# Altium schematic sheet Power.SchDoc
size A4; SheetNumber: 7; SheetTotal: 7
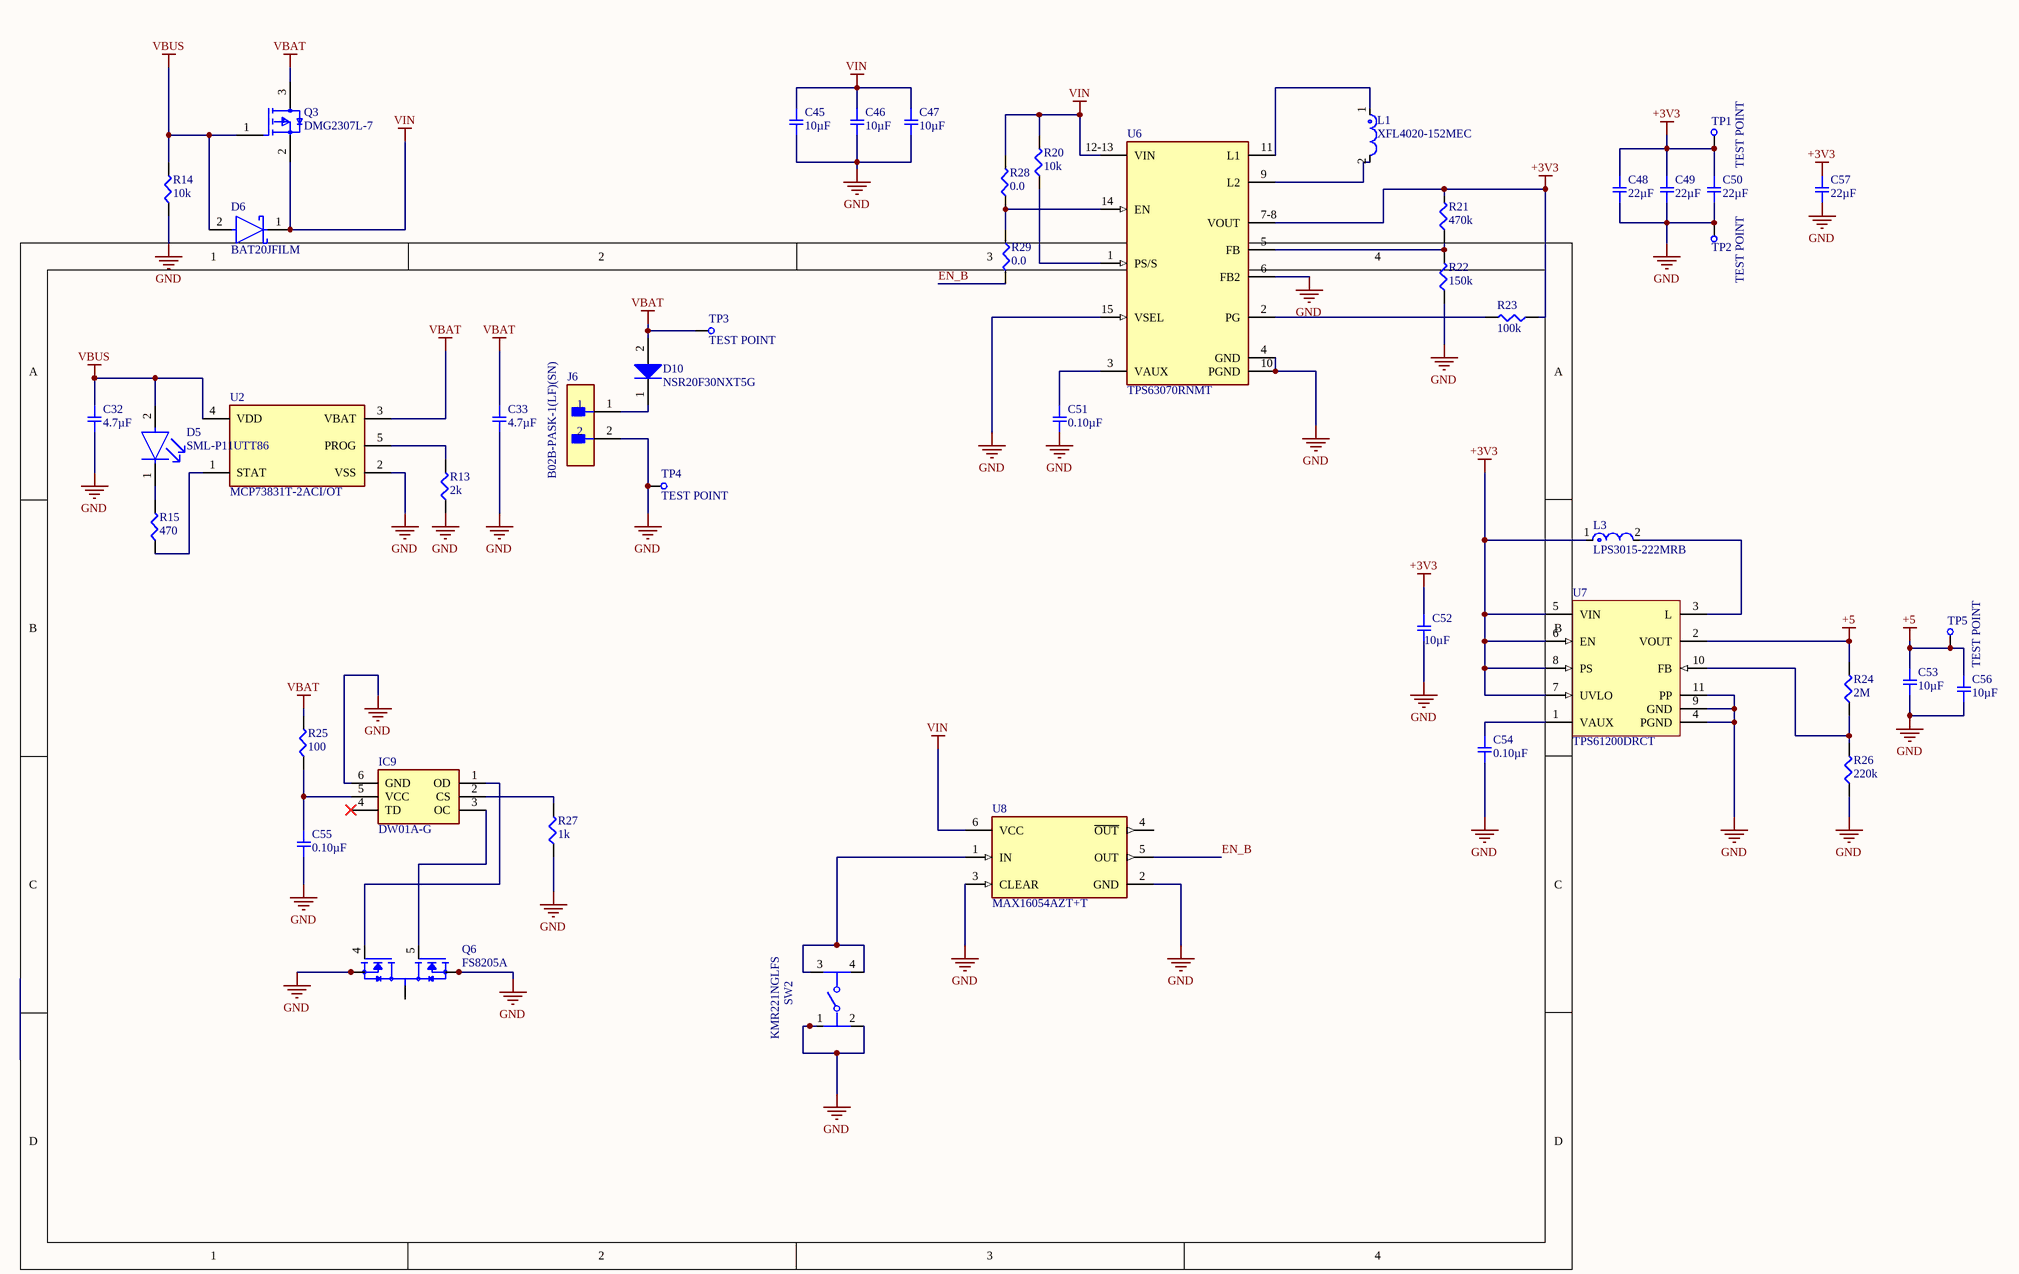
[diagram p0: Power.SchDoc]

## Parts
C32  4.7µF  [SMD-0402C]
C33  4.7µF  [SMD-0402C]
C45  10µF  [SMD-0805C]
C46  10µF  [SMD-0805C]
C47  10µF  [SMD-0603C]
C48  22µF  [SMD-0805C]
C49  22µF  [SMD-0805C]
C50  22µF  [SMD-0805C]
C51  0.10µF  [SMD-0402C]
C52  10µF  [SMD-0603C]
C53  10µF  [SMD-0603C]
C54  0.10µF  [SMD-0402C]
C55  0.10µF  [SMD-0402C]
C56  10µF  [SMD-0603C]
C57  22µF  [SMD-0603C]
D5  SML-P11UTT86  [FP-SML-P11UTT86-MFG]
D6  BAT20JFILM  [FP-BAT20JFILM-MFG]
D10  NSR20F30NXT5G  [ONSC-DSN-2-512AB-01_V]
IC9  DW01A-G  [SOT95P190X145-6N]
J6  B02B-PASK-1(LF)(SN)  [FP-B02B-PASK-1_LF_SN-MFG]
L1  XFL4020-152MEC  [FP-XFL4020-MFG]
L3  LPS3015-222MRB  [FP-LPS3015-MFG]
Q3  DMG2307L-7  [FP-SOT23-IPC_A]
Q6  FS8205A  [SOP65P640X120-8N]
R13  2k  [SMD-0402-RES]
R14  10k  [SMD-0402-RES]
R15  470  [SMD-0402-RES]
R20  10k  [SMD-0402-RES]
R21  470k  [SMD-0402-RES]
R22  150k  [SMD-0402-RES]
R23  100k  [SMD-0402-RES]
R24  2M  [SMD-0402-RES]
R25  100  [SMD-0402-RES]
R26  220k  [SMD-0402-RES]
R27  1k  [SMD-0402-RES]
R28  0.0  [SMD-0402-RES]
R29  0.0  [SMD-0402-RES]
SW2  KMR221NGLFS  [FP-KMR221NGLFS-0]
TP1  TEST POINT  [TEST POINT_30]
TP2  TEST POINT  [TEST POINT_30]
TP3  TEST POINT  [TEST POINT_30]
TP4  TEST POINT  [TEST POINT_30]
TP5  TEST POINT  [TEST POINT_30]
U2  MCP73831T-2ACI/OT  [FP-C04-091-OT-IPC_B]
U6  TPS63070RNMT  [FP-RNM0015A-MFG]
U7  TPS61200DRCT  [DRC0010J_V]
U8  MAX16054AZT+T  [FP-Z6-1-MFG]

## Nets
+3V3: C48.1 C49.1 C50.1 C52.1 C57.1 L3.1 R21.2 R23.1 TP1.1 U6.7-8(VOUT) U7.5(VIN) U7.6(EN) U7.7(UVLO) U7.8(PS)
+5: C53.1 C56.1 R24.2 TP5.1 U7.2(VOUT)
GND: C32.2 C33.2 C45.2 C46.2 C47.2 C48.2 C49.2 C50.2 C51.2 C52.2 C53.2 C54.2 C55.2 C56.2 C57.2 IC9.6(GND) J6.2 Q6.2(S1) Q6.3(S1) Q6.6(S2) Q6.7(S2) R13.1 R14.1 R22.1 R26.1 R27.1 SW2.1 SW2.2 TP2.1 TP4.1 U2.2(VSS) U6.4(GND) U6.6(FB2) U6.10(PGND) U6.15(VSEL) U7.4(PGND) U7.9(GND) U7.11(PP) U8.2(GND) U8.3(CLEAR)
VBAT: C33.1 D10.2(A) Q3.3(D) R25.2 TP3.1 U2.3(VBAT)
VBUS: C32.1 D5.2(A) D6.2(A) Q3.1(G) R14.2 U2.4(VDD)
VIN: C45.1 C46.1 C47.1 D6.1(K) Q3.2(S) R20.2 R28.2 U6.12-13(VIN) U8.6(VCC)
EN_B: R29.2 U8.5(OUT)
NetC51_1: C51.1 U6.3(VAUX)
NetC54_1: C54.1 U7.1(VAUX)
NetC55_1: C55.1 IC9.5(VCC) R25.1
NetD5_1: D5.1(C) R15.2
NetD10_1: D10.1(K) J6.1
NetIC9_1: IC9.1(OD) Q6.4(G1)
NetIC9_2: IC9.2(CS) R27.2
NetIC9_3: IC9.3(OC) Q6.5(G2)
NetL1_1: L1.1 U6.11(L1)
NetL1_2: L1.2 U6.9(L2)
NetL3_2: L3.2 U7.3(L)
NetQ6_1: Q6.1(D12) Q6.8(D12)
NetR13_2: R13.2 U2.5(PROG)
NetR15_1: R15.1 U2.1(STAT)
NetR20_1: R20.1 U6.1(PS/S)
NetR21_1: R21.1 R22.2 U6.5(FB)
NetR23_2: R23.2 U6.2(PG)
NetR24_1: R24.1 R26.2 U7.10(FB)
NetR28_1: R28.1 R29.1 U6.14(EN)
NetSW2_3: SW2.3 SW2.4 U8.1(IN)

Not connected (* = marked no-connect by the designer): IC9 4(TD)*; U8 4(~{OUT})

## Library data of the parts
C32 C33 = ZRB15XR61A475KE01D: CAP CER 4.7UF 10V X5R 0402; Manufacturer: Murata Electronics North America; Factory Stock: 0; Unit Price (USD): 0.28; Minimum Quantity: 1; Tolerance: ±10%; Datasheets: http://search.murata.co.jp/Ceramy/image/img/A01X/G101/ENG/ZRB15XR61A475KE01-01.pdf; Image: //media.digikey.com/Renders/Murata%20Renders/ZRB-SERIES-0402.jpg; Digi-Key Part Number: 490-13252-1-ND; Part Number: ZRB15XR61A475KE01D; Quantity Available: 23076; @ qty: 0; Packaging: Cut Tape (CT); Series: ZRB; Part Status: Active; Value: 4.7µF; Voltage: 10V; Temperature Coefficient: X5R; Operating Temperature: -55°C ~ 85°C; Features: Derating Recommended, Interposer Termination; Ratings: -; Applications: Acoustic Noise Reduction; Mounting Type: Surface Mount, MLCC; Package / Case: 0402 (1005 Metric); Size / Dimension: 0.039" L x 0.020" W (1.00mm x 0.50mm); Height - Seated (Max): -; Thickness (Max): 0.031" (0.80mm); Lead Spacing: -; Lead Style: -
C45 C46 = GCJ21BR71A106KE01L: CAP CER 10UF 10V X7R 0805; Manufacturer: Murata Electronics North America; Factory Stock: 0; Unit Price (USD): 0.56; Minimum Quantity: 1; Tolerance: ±10%; Datasheets: http://www.murata.com/~/media/webrenewal/support/library/catalog/products/capacitor/mlcc/c03e.ashx; Image: //media.digikey.com/Renders/Murata%20Renders/0805%20(2012%20Metric)%20.85mm.jpg; Digi-Key Part Number: 490-12646-1-ND; Part Number: GCJ21BR71A106KE01L; Quantity Available: 2702; @ qty: 0; Packaging: Cut Tape (CT); Series: GCJ; Part Status: Active; Value: 10µF; Voltage: 10V; Temperature Coefficient: X7R; Operating Temperature: -55°C ~ 125°C; Features: Soft Termination; Ratings: AEC-Q200; Applications: Automotive, Boardflex Sensitive; Mounting Type: Surface Mount, MLCC; Package / Case: 0805 (2012 Metric); Size / Dimension: 0.079" L x 0.049" W (2.00mm x 1.25mm); Height - Seated (Max): -; Thickness (Max): 0.057" (1.45mm); Lead Spacing: -; Lead Style: -
C47 = GRM188C81C106MA73D: CAP CER 10UF 16V X6S 0603; Manufacturer: Murata Electronics North America; Factory Stock: 0; Unit Price (USD): 0.34; Minimum Quantity: 1; Tolerance: ±20%; Datasheets: http://www.murata.com/~/media/webrenewal/support/library/catalog/products/capacitor/mlcc/c02e.pdf; Image: //media.digikey.com/Renders/Murata%20Renders/ZRB-SERIES-0402.jpg; Digi-Key Part Number: 490-7198-1-ND; Part Number: GRM188C81C106MA73D; Quantity Available: 215049; @ qty: 0; Packaging: Cut Tape (CT); Series: GRM; Part Status: Active; Value: 10µF; Voltage: 16V; Temperature Coefficient: X6S; Operating Temperature: -55°C ~ 105°C; Features: -; Ratings: -; Applications: General Purpose; Mounting Type: Surface Mount, MLCC; Package / Case: 0603 (1608 Metric); Size / Dimension: 0.063" L x 0.031" W (1.60mm x 0.80mm); Height - Seated (Max): -; Thickness (Max): 0.031" (0.80mm); Lead Spacing: -; Lead Style: -
C48-C50 = GRM219R61A226MEA0D: CAP CER 22UF 10V X5R 0805; Manufacturer: Murata Electronics North America; Factory Stock: 0; Unit Price (USD): 0.4; Minimum Quantity: 1; Tolerance: ±20%; Datasheets: http://www.murata.com/~/media/webrenewal/support/library/catalog/products/capacitor/mlcc/c02e.pdf; Image: //media.digikey.com/Renders/Murata%20Renders/0805%20(2012%20Metric)%20.85mm.jpg; Digi-Key Part Number: 490-9951-1-ND; Part Number: GRM219R61A226MEA0D; Quantity Available: 179544; @ qty: 0; Packaging: Cut Tape (CT); Series: GRM; Part Status: Active; Value: 22µF; Voltage: 10V; Temperature Coefficient: X5R; Operating Temperature: -55°C ~ 85°C; Features: Derating Recommended; Ratings: -; Applications: General Purpose; Mounting Type: Surface Mount, MLCC; Package / Case: 0805 (2012 Metric); Size / Dimension: 0.079" L x 0.049" W (2.00mm x 1.25mm); Height - Seated (Max): -; Thickness (Max): 0.037" (0.95mm); Lead Spacing: -; Lead Style: -
C51 C54 C55 = GCM155R71C104KA55D: CAP CER 0.1UF 16V X7R 0402; Manufacturer: Murata Electronics North America; Factory Stock: 0; Unit Price (USD): 0.1; Minimum Quantity: 1; Tolerance: ±10%; Datasheets: http://www.murata.com/~/media/webrenewal/support/library/catalog/products/capacitor/mlcc/c03e.ashx; Image: //media.digikey.com/Renders/Murata%20Renders/ZRB-SERIES-0402.jpg; Digi-Key Part Number: 490-4759-1-ND; Part Number: GCM155R71C104KA55D; Quantity Available: 734194; @ qty: 0; Packaging: Cut Tape (CT); Series: GCM; Part Status: Active; Value: 0.10µF; Voltage: 16V; Temperature Coefficient: X7R; Operating Temperature: -55°C ~ 125°C; Features: -; Ratings: AEC-Q200; Applications: Automotive; Mounting Type: Surface Mount, MLCC; Package / Case: 0402 (1005 Metric); Size / Dimension: 0.039" L x 0.020" W (1.00mm x 0.50mm); Height - Seated (Max): -; Thickness (Max): 0.022" (0.55mm); Lead Spacing: -; Lead Style: -
C52 C53 C56 = GRM188R61C106MAALD: CAP CER 10UF 16V X5R 0603; Manufacturer: Murata Electronics North America; Factory Stock: 0; Unit Price (USD): 0.34; Minimum Quantity: 1; Tolerance: ±20%; Datasheets: http://www.murata.com/~/media/webrenewal/support/library/catalog/products/capacitor/mlcc/c02e.pdf; Image: //media.digikey.com/Renders/Murata%20Renders/ZRB-SERIES-0402.jpg; Digi-Key Part Number: 490-10729-1-ND; Part Number: GRM188R61C106MAALD; Quantity Available: 8571; @ qty: 0; Packaging: Cut Tape (CT); Series: GRM; Part Status: Active; Value: 10µF; Voltage: 16V; Temperature Coefficient: X5R; Operating Temperature: -55°C ~ 85°C; Features: -; Ratings: -; Applications: General Purpose; Mounting Type: Surface Mount, MLCC; Package / Case: 0603 (1608 Metric); Size / Dimension: 0.063" L x 0.031" W (1.60mm x 0.80mm); Height - Seated (Max): -; Thickness (Max): 0.037" (0.95mm); Lead Spacing: -; Lead Style: -
C57 = GRM187R61A226ME15D: CAP CER 22UF 10V X5R 0603; Manufacturer: Murata Electronics North America; Factory Stock: 0; Unit Price (USD): 0.54; Minimum Quantity: 1; Tolerance: ±20%; Datasheets: http://psearch.en.murata.com/capacitor/product/GRM187R61A226ME15%23.pdf; Image: //media.digikey.com/Renders/Murata%20Renders/ZRB-SERIES-0402.jpg; Digi-Key Part Number: 490-13243-1-ND; Part Number: GRM187R61A226ME15D; Quantity Available: 10253; @ qty: 0; Packaging: Cut Tape (CT); Series: GRM; Part Status: Active; Value: 22µF; Voltage: 10V; Temperature Coefficient: X5R; Operating Temperature: -55°C ~ 85°C; Features: Derating Recommended; Ratings: -; Applications: General Purpose; Mounting Type: Surface Mount, MLCC; Package / Case: 0603 (1608 Metric); Size / Dimension: 0.063" L x 0.031" W (1.60mm x 0.80mm); Height - Seated (Max): -; Thickness (Max): 0.031" (0.80mm); Lead Spacing: -; Lead Style: -
D5 = CMP-08952-000028-1: LED RED CLEAR 1006 SMD; Number of LEDs: 1; Lens Color: Colorless; Viewing Angle: 150°; Dominant Wavelength: 621nm; Luminous Intensity: 5.5mcd; Forward Voltage: 1.8V; Lens Style: Square; Test Current: 1mA; Forward Current: 20mA; Height: 0.25mm; Radiation Hardening: No; Color: Red; Case Code (Metric): 1005; Number of Pins: 2; RoHS Compliant: Yes; Max Operating Temperature: 85°C; Package Quantity: 1; Wavelength: 621nm; Lens Transparency: Clear; Packaging: Tape and Reel; Lead Free: Lead Free; Illumination Color: Red; Case/Package: 0402; Case Code (Imperial): 0402; Mount: Surface Mount; Min Operating Temperature: -40°C; Width: 0.6mm; Length: 1mm; Series: PicoLED™; REACH SVHC: No SVHC
D6 = CMP-12187-000030-1: DIODE SCHOTTKY 23V 1A SOD323; Polarity: Standard; Element Configuration: Single; Capacitance: 30pF; Forward Voltage: 620mV; Max Surge Current: 5A; Peak Reverse Current: 12uA; Packaging: Tape and Reel; Weight: 0.01lb; Output Current: 1A; Lead Free: Lead Free; Forward Current: 1A; Mount: Surface Mount; Max Reverse Voltage (DC): 23V; Average Rectified Current: 1A; Max Operating Temperature: 150°C; Max Forward Surge Current (Ifsm): 5A; REACH SVHC: No SVHC; Current Rating: 1A; Length: 1.8mm; Radiation Hardening: No; Max Reverse Leakage Current: 12uA; Voltage Rating (DC): 23V; Height: 1.03mm; Peak Non-Repetitive Surge Current: 5A; Max Repetitive Reverse Voltage (Vrrm): 23V; Min Operating Temperature: -65°C; Number of Pins: 2; Width: 1.35mm; Package Quantity: 1
D10 = CMP-1055-00233-1: Schottky Barrier Diode, 2-Pin DSN, Pb-Free, Tape and Reel; Manufacturer: On Semiconductor; IFSM Max (A): 28; Configuration: Single; ComponentLink2URL: http://www.onsemi.com/pub_link/Collateral/NSR20F30-D.PDF; ComponentLink1URL: http://www.onsemi.com/; ComponentLink2Description: Datasheet; PackageVersion: Rev. B, 01/2011; Mounting Technology: Surface Mount; DatasheetVersion: Rev. 3; Packing: Tape and Reel; PartNumber: NSR20F30NXT5G; ComponentLink3Description: Package Specification; RoHS: TRUE; PackageDescription: 2-Pin Micro Molded Package, Body 1.6 x 0.8 mm; ComponentLink3URL: http://www.onsemi.cn/pub_link/Collateral/152AB.PDF; ComponentLink1Description: Manufacturer URL; PackageReference: DSN-2-512AB-01
IC9 = DW01A-G: Integrated Circuit; Manufacturer_Name: SII Semiconductor; Datasheet Link: http://www.ic-fortune.com/upload/Download/DW01x-DS-17_EN.pdf; Height: 1.45mm; Manufacturer_Part_Number: DW01A-G
J6 = CMP-17439-000415-1: CONN HEADER VERT 2POS 2MM; Number of Contacts: 2; Current Rating: 3A; Insulation Resistance: 1GR; Mated Stacking Heights: 14.9mm; Voltage Rating: 250V; Gender: Male; Pitch: 2mm; Orientation: Straight; Contact Finish - Mating: TIN; Mount: Through Hole; Contact Type: Male Pin; Number of Rows: 1; Fastening Type: Ramp; Series: PA; Connector Type: Header; Insulation Color: Natural; Flammability Rating: UL94 V-0; Material: Polybutylene; Contact Shape: Square; Contact Plating: Tin; Insulation Material: PBT; Max Operating Temperature: 85°C; Housing Color: White; Number of Positions: 2; Contact Material: Copper Alloy; Min Operating Temperature: -25°C; Lead Free: Lead Free; Contact Mating Length: 0.126inch; Termination: Solder; Packaging: Bulk; Color: Natural
L1 = CMP-11268-000104-1: Inductor Power Shielded Wirewound 1.5uH 20% 100KHz 9.1A 15.8mOhm DCR 1515 Automotive Embossed Plastic T/R; Core Material: Composite; DC Resistance (DCR): 15.8mR; Saturation Current: 4.1A; Self Resonant Frequency: 59MHz; Tolerance: 20%; Inductance: 1.5uH; Max DC Current: 9.1A; RoHS Compliant: Yes; Max Operating Temperature: 125°C; Length: 4.3mm; Case/Package: SMD/SMT; Mount: Surface Mount; Shielding: Shielded; Min Operating Temperature: -40°C; RMS Current (Irms): 9.1A; Test Frequency: 100kHz; Inductance Tolerance: 20%; REACH SVHC: No SVHC; Packaging: Tape and Reel; Termination: SMD/SMT; Lead Free: Contains Lead; Width: 4.3mm; Series: XFL4020; Height: 2.1mm
L3 = CMP-2000-06574-2: Fixed Inductors LPS3015 AEC-Q200 2.2uH 1.4A 20% SMD; Max DC Current: 2.1A; RMS Current (Irms): 1.1A; DC Resistance (DCR): 110mR; Core Material: Ferrite; Saturation Current: 2A; Shielding: Shielded; Test Frequency: 100kHz; Self Resonant Frequency: 110MHz; REACH SVHC: No SVHC; Weight: 0.001411oz; Height: 1.4mm; Max Operating Temperature: 85°C; Termination: SMD/SMT; Inductance Tolerance: 20%; Packaging: Cut Tape; Min Operating Temperature: -40°C; Inductance: 2.2uH; Width: 3mm; Package Quantity: 1; Tolerance: 20%; Length: 3mm
Q3 = CMP-12801-000080-1: MOSFET P-CH 30V 2.5A SOT-23; Gate to Source Voltage (Vgs): 20V; Rise Time: 7.3ns; Power Dissipation: 1.36W; Rds On Max: 90mR; Fall Time: 13.4ns; Number of Channels: 1; Turn-On Delay Time: 4.8ns; Element Configuration: Single; Turn-Off Delay Time: 22.4ns; Input Capacitance: 371.3pF; Continuous Drain Current (ID): 3.8A; Max Power Dissipation: 760mW; Min Operating Temperature: -55°C; Width: 1.4mm; Packaging: Tape and Reel; Max Operating Temperature: 150°C; Case/Package: SOT-23; Weight: 0.000282oz; Length: 3mm; Lead Free: Lead Free; Package Quantity: 3000; Radiation Hardening: No; Drain to Source Resistance: 90mR; Height: 1mm; REACH SVHC: No SVHC; Number of Pins: 3; Number of Elements: 1; Drain to Source Voltage (Vdss): 30V; Mount: Surface Mount
Q6 = FS8205A: N/A; MF: Fortune Semiconductor; MP: FS8205A; Value: *; Availability: Not in stock; Package: Package; Price: None; SnapEDA_Link: https://www.snapeda.com/parts/FS8205A/Fortune+Semiconductor/view-part/?ref=snap; Check_prices: https://www.snapeda.com/parts/FS8205A/Fortune+Semiconductor/view-part/?ref=eda
R13 = ERJ-2GEJ202X: RES SMD 2K OHM 5% 1/10W 0402; Manufacturer: Panasonic Electronic Components; Factory Stock: 0; Unit Price (USD): 0.00350; @ qty: 1500; Minimum Quantity: 1; Power (Watts): 0.1W, 1/10W; Temperature Coefficient: ±200ppm/°C; Part Number: ERJ-2GEJ202X; Datasheets: http://industrial.panasonic.com/www-cgi/jvcr13pz.cgi?E+PZ+3+AOA0001+ERJ2GEJ202X+7+WW; Image: //media.digikey.com/Photos/Panasonic%20Photos/ERJ-PA2-Series.jpg; Digi-Key Part Number: P2.0KJCT-ND; Quantity Available: 185761; Packaging: Cut Tape (CT); Series: ERJ; Part Status: Active; Value: 2k; Tolerance: ±5%; Composition: Thick Film; Features: Automotive AEC-Q200; Operating Temperature: -55°C ~ 155°C; Package / Case: 0402 (1005 Metric); Supplier Device Package: 0402; Size / Dimension: 0.039" L x 0.020" W (1.00mm x 0.50mm); Height - Seated (Max): 0.016" (0.40mm); Number of Terminations: 2; Failure Rate: -
R14 R20 = ERJ-2GEJ103X: RES SMD 10K OHM 5% 1/10W 0402; Manufacturer: Panasonic Electronic Components; Factory Stock: 0; Unit Price (USD): 0.00350; @ qty: 1500; Minimum Quantity: 1; Power (Watts): 0.1W, 1/10W; Temperature Coefficient: ±200ppm/°C; Part Number: ERJ-2GEJ103X; Datasheets: http://industrial.panasonic.com/www-cgi/jvcr13pz.cgi?E+PZ+3+AOA0001+ERJ2GEJ103X+7+WW; Image: //media.digikey.com/Photos/Panasonic%20Photos/ERJ-PA2-Series.jpg; Digi-Key Part Number: P10KJCT-ND; Quantity Available: 2560215; Packaging: Cut Tape (CT); Series: ERJ; Part Status: Active; Value: 10k; Tolerance: ±5%; Composition: Thick Film; Features: Automotive AEC-Q200; Operating Temperature: -55°C ~ 155°C; Package / Case: 0402 (1005 Metric); Supplier Device Package: 0402; Size / Dimension: 0.039" L x 0.020" W (1.00mm x 0.50mm); Height - Seated (Max): 0.016" (0.40mm); Number of Terminations: 2; Failure Rate: -
R15 = ERJ-2RKF4700X: RES SMD 470 OHM 1% 1/10W 0402; Manufacturer: Panasonic Electronic Components; Factory Stock: 0; Unit Price (USD): 0.00496; @ qty: 1500; Minimum Quantity: 1; Power (Watts): 0.1W, 1/10W; Temperature Coefficient: ±100ppm/°C; Part Number: ERJ-2RKF4700X; Datasheets: http://industrial.panasonic.com/www-cgi/jvcr13pz.cgi?E+PZ+3+AOA0002+ERJ2RKF4700X+7+WW; Image: //media.digikey.com/Photos/Panasonic%20Photos/ERJ-PA2-Series.jpg; Digi-Key Part Number: P470LCT-ND; Quantity Available: 52644; Packaging: Cut Tape (CT); Series: ERJ; Part Status: Active; Value: 470; Tolerance: ±1%; Composition: Thick Film; Features: Automotive AEC-Q200; Operating Temperature: -55°C ~ 155°C; Package / Case: 0402 (1005 Metric); Supplier Device Package: 0402; Size / Dimension: 0.039" L x 0.020" W (1.00mm x 0.50mm); Height - Seated (Max): 0.016" (0.40mm); Number of Terminations: 2; Failure Rate: -
R21 = ERJ-2RKF4703X: RES SMD 470K OHM 1% 1/10W 0402; Manufacturer: Panasonic Electronic Components; Factory Stock: 0; Unit Price (USD): 0.00496; @ qty: 1500; Minimum Quantity: 1; Power (Watts): 0.1W, 1/10W; Temperature Coefficient: ±100ppm/°C; Part Number: ERJ-2RKF4703X; Datasheets: http://industrial.panasonic.com/www-cgi/jvcr13pz.cgi?E+PZ+3+AOA0002+ERJ2RKF4703X+7+WW; Image: //media.digikey.com/Photos/Panasonic%20Photos/ERJ-PA2-Series.jpg; Digi-Key Part Number: P470KLCT-ND; Quantity Available: 171557; Packaging: Cut Tape (CT); Series: ERJ; Part Status: Active; Value: 470k; Tolerance: ±1%; Composition: Thick Film; Features: Automotive AEC-Q200; Operating Temperature: -55°C ~ 155°C; Package / Case: 0402 (1005 Metric); Supplier Device Package: 0402; Size / Dimension: 0.039" L x 0.020" W (1.00mm x 0.50mm); Height - Seated (Max): 0.016" (0.40mm); Number of Terminations: 2; Failure Rate: -
R22 = ERJ-2GEJ154X: RES SMD 150K OHM 5% 1/10W 0402; Manufacturer: Panasonic Electronic Components; Factory Stock: 0; Unit Price (USD): 0.00350; @ qty: 1500; Minimum Quantity: 1; Power (Watts): 0.1W, 1/10W; Temperature Coefficient: ±200ppm/°C; Part Number: ERJ-2GEJ154X; Datasheets: http://industrial.panasonic.com/www-cgi/jvcr13pz.cgi?E+PZ+3+AOA0001+ERJ2GEJ154X+7+WW; Image: //media.digikey.com/Photos/Panasonic%20Photos/ERJ-PA2-Series.jpg; Digi-Key Part Number: P150KJCT-ND; Quantity Available: 100107; Packaging: Cut Tape (CT); Series: ERJ; Part Status: Active; Value: 150k; Tolerance: ±5%; Composition: Thick Film; Features: Automotive AEC-Q200; Operating Temperature: -55°C ~ 155°C; Package / Case: 0402 (1005 Metric); Supplier Device Package: 0402; Size / Dimension: 0.039" L x 0.020" W (1.00mm x 0.50mm); Height - Seated (Max): 0.016" (0.40mm); Number of Terminations: 2; Failure Rate: -
R23 = ERJ-2GEJ104X: RES SMD 100K OHM 5% 1/10W 0402; Manufacturer: Panasonic Electronic Components; Factory Stock: 0; Unit Price (USD): 0.00350; @ qty: 1500; Minimum Quantity: 1; Power (Watts): 0.1W, 1/10W; Temperature Coefficient: ±200ppm/°C; Part Number: ERJ-2GEJ104X; Datasheets: http://industrial.panasonic.com/www-cgi/jvcr13pz.cgi?E+PZ+3+AOA0001+ERJ2GEJ104X+7+WW; Image: //media.digikey.com/Photos/Panasonic%20Photos/ERJ-PA2-Series.jpg; Digi-Key Part Number: P100KJCT-ND; Quantity Available: 2387986; Packaging: Cut Tape (CT); Series: ERJ; Part Status: Active; Value: 100k; Tolerance: ±5%; Composition: Thick Film; Features: Automotive AEC-Q200; Operating Temperature: -55°C ~ 155°C; Package / Case: 0402 (1005 Metric); Supplier Device Package: 0402; Size / Dimension: 0.039" L x 0.020" W (1.00mm x 0.50mm); Height - Seated (Max): 0.016" (0.40mm); Number of Terminations: 2; Failure Rate: -
R24 = ERJ-2GEJ205X: RES SMD 2M OHM 5% 1/10W 0402; Manufacturer: Panasonic Electronic Components; Factory Stock: 0; Unit Price (USD): 0.00350; @ qty: 1500; Minimum Quantity: 1; Power (Watts): 0.1W, 1/10W; Temperature Coefficient: -400/ +150ppm/°C; Part Number: ERJ-2GEJ205X; Datasheets: http://industrial.panasonic.com/www-cgi/jvcr13pz.cgi?E+PZ+3+AOA0001+ERJ2GEJ205X+7+WW; Image: //media.digikey.com/Photos/Panasonic%20Photos/ERJ-PA2-Series.jpg; Digi-Key Part Number: P2.0MJCT-ND; Quantity Available: 395013; Packaging: Cut Tape (CT); Series: ERJ; Part Status: Active; Value: 2M; Tolerance: ±5%; Composition: Thick Film; Features: Automotive AEC-Q200; Operating Temperature: -55°C ~ 155°C; Package / Case: 0402 (1005 Metric); Supplier Device Package: 0402; Size / Dimension: 0.039" L x 0.020" W (1.00mm x 0.50mm); Height - Seated (Max): 0.016" (0.40mm); Number of Terminations: 2; Failure Rate: -
R25 = ERJ-2RKF1000X: RES SMD 100 OHM 1% 1/10W 0402; Manufacturer: Panasonic Electronic Components; Factory Stock: 0; Unit Price (USD): 0.00496; @ qty: 1500; Minimum Quantity: 1; Power (Watts): 0.1W, 1/10W; Temperature Coefficient: ±100ppm/°C; Part Number: ERJ-2RKF1000X; Datasheets: http://industrial.panasonic.com/www-cgi/jvcr13pz.cgi?E+PZ+3+AOA0002+ERJ2RKF1000X+7+WW; Image: //media.digikey.com/Photos/Panasonic%20Photos/ERJ-PA2-Series.jpg; Digi-Key Part Number: P100LCT-ND; Quantity Available: 2283953; Packaging: Cut Tape (CT); Series: ERJ; Part Status: Active; Value: 100; Tolerance: ±1%; Composition: Thick Film; Features: Automotive AEC-Q200; Operating Temperature: -55°C ~ 155°C; Package / Case: 0402 (1005 Metric); Supplier Device Package: 0402; Size / Dimension: 0.039" L x 0.020" W (1.00mm x 0.50mm); Height - Seated (Max): 0.016" (0.40mm); Number of Terminations: 2; Failure Rate: -
R26 = ERJ-2GEJ224X: RES SMD 220K OHM 5% 1/10W 0402; Manufacturer: Panasonic Electronic Components; Factory Stock: 0; Unit Price (USD): 0.00350; @ qty: 1500; Minimum Quantity: 1; Power (Watts): 0.1W, 1/10W; Temperature Coefficient: ±200ppm/°C; Part Number: ERJ-2GEJ224X; Datasheets: http://industrial.panasonic.com/www-cgi/jvcr13pz.cgi?E+PZ+3+AOA0001+ERJ2GEJ224X+7+WW; Image: //media.digikey.com/Photos/Panasonic%20Photos/ERJ-PA2-Series.jpg; Digi-Key Part Number: P220KJCT-ND; Quantity Available: 84801; Packaging: Cut Tape (CT); Series: ERJ; Part Status: Active; Value: 220k; Tolerance: ±5%; Composition: Thick Film; Features: Automotive AEC-Q200; Operating Temperature: -55°C ~ 155°C; Package / Case: 0402 (1005 Metric); Supplier Device Package: 0402; Size / Dimension: 0.039" L x 0.020" W (1.00mm x 0.50mm); Height - Seated (Max): 0.016" (0.40mm); Number of Terminations: 2; Failure Rate: -
R27 = ERJ-2GEJ102X: RES SMD 1K OHM 5% 1/10W 0402; Manufacturer: Panasonic Electronic Components; Factory Stock: 0; Unit Price (USD): 0.00350; @ qty: 1500; Minimum Quantity: 1; Power (Watts): 0.1W, 1/10W; Temperature Coefficient: ±200ppm/°C; Part Number: ERJ-2GEJ102X; Datasheets: http://industrial.panasonic.com/www-cgi/jvcr13pz.cgi?E+PZ+3+AOA0001+ERJ2GEJ102X+7+WW; Image: //media.digikey.com/Photos/Panasonic%20Photos/ERJ-PA2-Series.jpg; Digi-Key Part Number: P1.0KJCT-ND; Quantity Available: 1939857; Packaging: Cut Tape (CT); Series: ERJ; Part Status: Active; Value: 1k; Tolerance: ±5%; Composition: Thick Film; Features: Automotive AEC-Q200; Operating Temperature: -55°C ~ 155°C; Package / Case: 0402 (1005 Metric); Supplier Device Package: 0402; Size / Dimension: 0.039" L x 0.020" W (1.00mm x 0.50mm); Height - Seated (Max): 0.016" (0.40mm); Number of Terminations: 2; Failure Rate: -
R28 R29 = ERJ-2GE0R00X: RES SMD 0.0OHM JUMPER 1/10W 0402; Manufacturer: Panasonic Electronic Components; Factory Stock: 0; Unit Price (USD): 0.00384; @ qty: 1500; Minimum Quantity: 1; Power (Watts): 0.1W, 1/10W; Part Number: ERJ-2GE0R00X; Datasheets: http://industrial.panasonic.com/www-cgi/jvcr13pz.cgi?E+PZ+3+AOA0001+ERJ2GE0R00X+7+WW; Image: //media.digikey.com/Photos/Panasonic%20Photos/ERJ-PA2-Series.jpg; Digi-Key Part Number: P0.0JCT-ND; Quantity Available: 3152483; Packaging: Cut Tape (CT); Series: ERJ; Part Status: Active; Value: 0.0; Tolerance: Jumper; Composition: Thick Film; Features: Automotive AEC-Q200; Temperature Coefficient: -; Operating Temperature: -55°C ~ 155°C; Package / Case: 0402 (1005 Metric); Supplier Device Package: 0402; Size / Dimension: 0.039" L x 0.020" W (1.00mm x 0.50mm); Height - Seated (Max): 0.016" (0.40mm); Number of Terminations: 2; Failure Rate: -
SW2 = CMP-10040-000006-1: SWITCH TACTILE SPST-NO 0.05A 32V; Manufacturer: C&K; Contact Current Rating: 50mA; Operating Force: 2N; Contact Resistance: 100mΩ; Electromechanical Life: 200000Cycles; Digikey Description: SWITCH TACTILE SPST-NO 0.05A 32V; Manufacturer Part Number: KMR221NGLFS; Octopart: https://octopart.com/kmr221nglfs-c%26k+components-7203802; Package: 0; Temperature: -40°C to +85°C; Mount: Surface Mount; Device Class L2: Switches; Height: 1.9mm; Device Class L3: Tactile Switches; RoHS: TRUE; Lead Free: Yes; ComponentLink2Description: Datasheet; Device Class L1: Electromechanical; Automotive: No; Mouser Description: Tactile Switches Tact; Category: Switch; Temperature Range High: +85°C; Temperature Range Low: -40°C; Voltage Rating Dc: 32V; ComponentLink2URL: https://dznh3ojzb2azq.cloudfront.net/products/Tactile/KMR2/documents/datasheet.pdf; Throw Configuration: SPST-NO
TP1-TP5 = TEST POINT: 0.4mm hole size Test point; Manufacturer Part Number: NA; Case/Package: TH; Manufacturer: NA; Supplier-1: NA; Supplier Part Number-1: NA; Alternate Part Number-1: NA
U2 = CMP-0133-00143-2: IC CONTROLLR LI-ION 4.2V SOT23-5; Max Power Dissipation: 1.54W; Output Current: 500mA; Max Output Voltage: 4.5V; Number of Outputs: 1; Min Output Voltage: 4.168V; Min Supply Voltage: 3.75V; Max Input Voltage: 6V; Voltage Rating: 4.534V; Drain to Source Resistance: 350mR; Max Operating Temperature: 85°C; Length: 0.122inch; Number of Pins: 5; REACH SVHC: No SVHC; Radiation Hardening: No; Min Operating Temperature: -40°C; Weight: 0.00709oz; Contact Plating: Tin; Termination: SMD/SMT; Case/Package: SOT-23; Mount: Surface Mount; Width: 0.071inch; Packaging: Tape and Reel; Number of Cells: 1; Max Charge Current: 500mA; Height: 0.051inch; Number of Channels: 1; Output Voltage: 4.2V; Max Supply Voltage: 6V; Lead Free: Lead Free
U6 = CMP-04918-000001-1: IC REG BCK BST ADJ 2A 15VQFN; Manufacturer: Texas Instruments; Number Of Outputs: 1; Max Duty Cycle: 100%; Output Type: AdjustableProgrammable; Max Supply Voltage: 16V; Max Junction Temp: +125°C; Switching Topology: Buck-Boost; Output Voltage: 2.5-9V; Standoff Height: 0mm; Min Supply Voltage: 2V; Switching Frequency: 2400kHz; Nominal Supply Current: 5-54uA; Temperature: -40°C to +125°C; Manufacturer Part Number: TPS63070RNMT; Device Class L1: Integrated Circuits (ICs); RoHS: TRUE; Package: RNM0015A; Octopart: https://octopart.com/tps63070rnmt-texas+instruments-75117739; Output Current: 2A; Device Class L3: Voltage Regulators - Switching; Temperature Range High: +125°C; ComponentLink2Description: Datasheet; ComponentLink2URL: http://www.ti.com/lit/ds/symlink/tps63070.pdf; Lead Free: Yes; Device Class L2: Power Management ICs; Automotive: No; Height: 1mm; Temperature Range Low: -40°C; Category: IC; Digikey Description: IC REG BCK BST ADJ 2A 15VQFN
U7 = CMP-0347-00023-2: Boost Voltage Converter with 0.3 to 5.5 V Input and 1.8 to 5.5 V Output, -40 to 85 degC, 10-Pin SON (DRC), Green (RoHS & no Sb/Br); Manufacturer: Texas Instruments; Vout(Min)(V): 1.8; SubFamily: Step-Up Regulator; Vin(Min)(V): 0.3; Vout(Max)(V): 5.5; Switching Frequency(Max)(kHz): 1250; Regulated Outputs(#): 1; Synchronous Rectification: TRUE; Mounting Technology: Surface Mount; Eco-Plan: Green (RoHS & no Sb/Br); DatasheetVersion: SLVS577B; ComponentLink1Description: Datasheet; PartNumber: TPS61200DRCT; Topology: Boost; PackageVersion: revL, Sep-2011; ComponentLink1URL: http://www.ti.com/general/docs/lit/getliterature.tsp?genericPartNumber=TPS61200&fileType=pdf; PackageDescription: 10-Pin Plastic Small Outline No-Lead, 3 x 3 x 1 mm Body, 0.5 mm Pitch, Exposed Pad; PackageReference: DRC0010J; Vin(Max)(V): 5.5; ComponentLink2Description: Package Specification; ComponentLink2URL: http://www.ti.com/litv/pdf/mpds117k
U8 = CMP-0251-00627-2: IC INTFACE SPECIALIZED TSOT23-6; Undervoltage Threshold: 1.8V; Max Supply Voltage: 5.5V; Min Supply Voltage: 2.7V; Max Power Dissipation: 727W; Number of Voltages Monitored: 1; Watchdog Timer: No; Operating Supply Current: 7uA; Output Type: PUSH-PULL; RoHS Compliant: Yes; Series: -; Contact Plating: Tin; Length: 4mm; Height: 0.73mm; Radiation Hardening: No; Number of Pins: 6; Min Operating Temperature: -40°C; Width: 4mm; Mount: Surface Mount; Package Quantity: 1; Max Operating Temperature: 125°C; Packaging: Tape and Reel; Case/Package: SOT-23-6